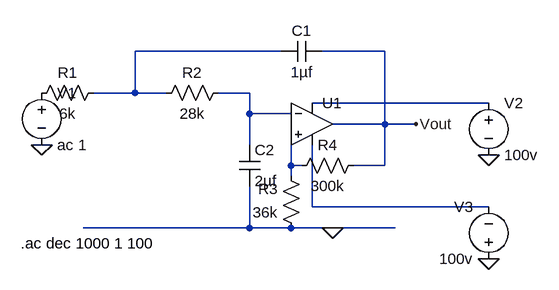
[diagram p0: schematic ButterWorth.asc]
ButterWorth.asc, the LTspice schematic file:
Version 4
SHEET 1 880 680
WIRE 288 -80 64 -80
WIRE 448 -80 352 -80
WIRE 64 -16 64 -80
WIRE 64 -16 0 -16
WIRE 112 -16 64 -16
WIRE 240 -16 192 -16
WIRE 608 0 336 0
WIRE 240 16 240 -16
WIRE 304 16 240 16
WIRE 448 32 448 -80
WIRE 448 32 368 32
WIRE 496 32 448 32
WIRE 240 64 240 16
WIRE 304 96 304 48
WIRE 320 96 304 96
WIRE 448 96 448 32
WIRE 448 96 400 96
WIRE 304 112 304 96
WIRE 336 160 336 64
WIRE 608 160 336 160
WIRE 240 192 240 128
WIRE 240 192 -16 192
WIRE 304 192 240 192
WIRE 368 192 304 192
WIRE 464 192 368 192
FLAG 368 192 0
FLAG -80 64 0
FLAG 496 32 Vout
FLAG 608 80 0
FLAG 608 240 0
SYMBOL res 16 -32 R90
WINDOW 0 0 56 VBottom 2
WINDOW 3 32 56 VTop 2
SYMATTR InstName R1
SYMATTR Value 6k
SYMBOL res 208 -32 R90
WINDOW 0 0 56 VBottom 2
WINDOW 3 32 56 VTop 2
SYMATTR InstName R2
SYMATTR Value 28k
SYMBOL cap 352 -96 R90
WINDOW 0 0 32 VBottom 2
WINDOW 3 32 32 VTop 2
SYMATTR InstName C1
SYMATTR Value 1µf
SYMBOL cap 224 64 R0
SYMATTR InstName C2
SYMATTR Value 2µf
SYMBOL OpAmps\\UniversalOpamp2 336 32 R0
SYMATTR InstName U1
SYMBOL res 320 208 R180
WINDOW 0 36 76 Left 2
WINDOW 3 36 40 Left 2
SYMATTR InstName R3
SYMATTR Value 36k
SYMBOL res 416 80 R90
WINDOW 0 0 56 VBottom 2
WINDOW 3 32 56 VTop 2
SYMATTR InstName R4
SYMATTR Value 300k
SYMBOL voltage -80 -32 R0
SYMATTR InstName V1
SYMATTR Value ac 1
SYMBOL voltage 608 -16 R0
SYMATTR InstName V2
SYMATTR Value 100v
SYMBOL voltage 608 256 R180
WINDOW 0 24 96 Left 2
WINDOW 3 24 16 Left 2
WINDOW 123 0 0 Left 0
WINDOW 39 0 0 Left 0
SYMATTR InstName V3
SYMATTR Value 100v
TEXT -112 216 Left 2 !.ac dec 1000 1 100

The netlist it stands for:
* ButterWorth.asc
R1 N001 P001 6k
R2 N002 N001 28k
C1 Vout N001 1µf
C2 N002 0 2µf
XU1 N004 N002 N003 N005 Vout level.2 Avol=1Meg GBW=10Meg Slew=10Meg ilimit=25m rail=0 Vos=0 phimargin=45 en=0 enk=0 in=0 ink=0 Rin=500Meg  ; pins IN+ IN- V+ V- OUT
R3 0 N004 36k
R4 Vout N004 300k
V1 P001 0 ac 1
V2 N003 0 100v
V3 0 N005 100v
.ac dec 1000 1 100
.lib UniversalOpamps2.sub
.backanno
.end